# Altium schematic sheet arm-debugger.SchDoc
size A3; DrawnBy: strawberryhacker; SheetNumber: 1; SheetTotal: 1; Email: strawberryhacker@outlook.com; Github: https://github.com/strawberryhacker; Year: 2021
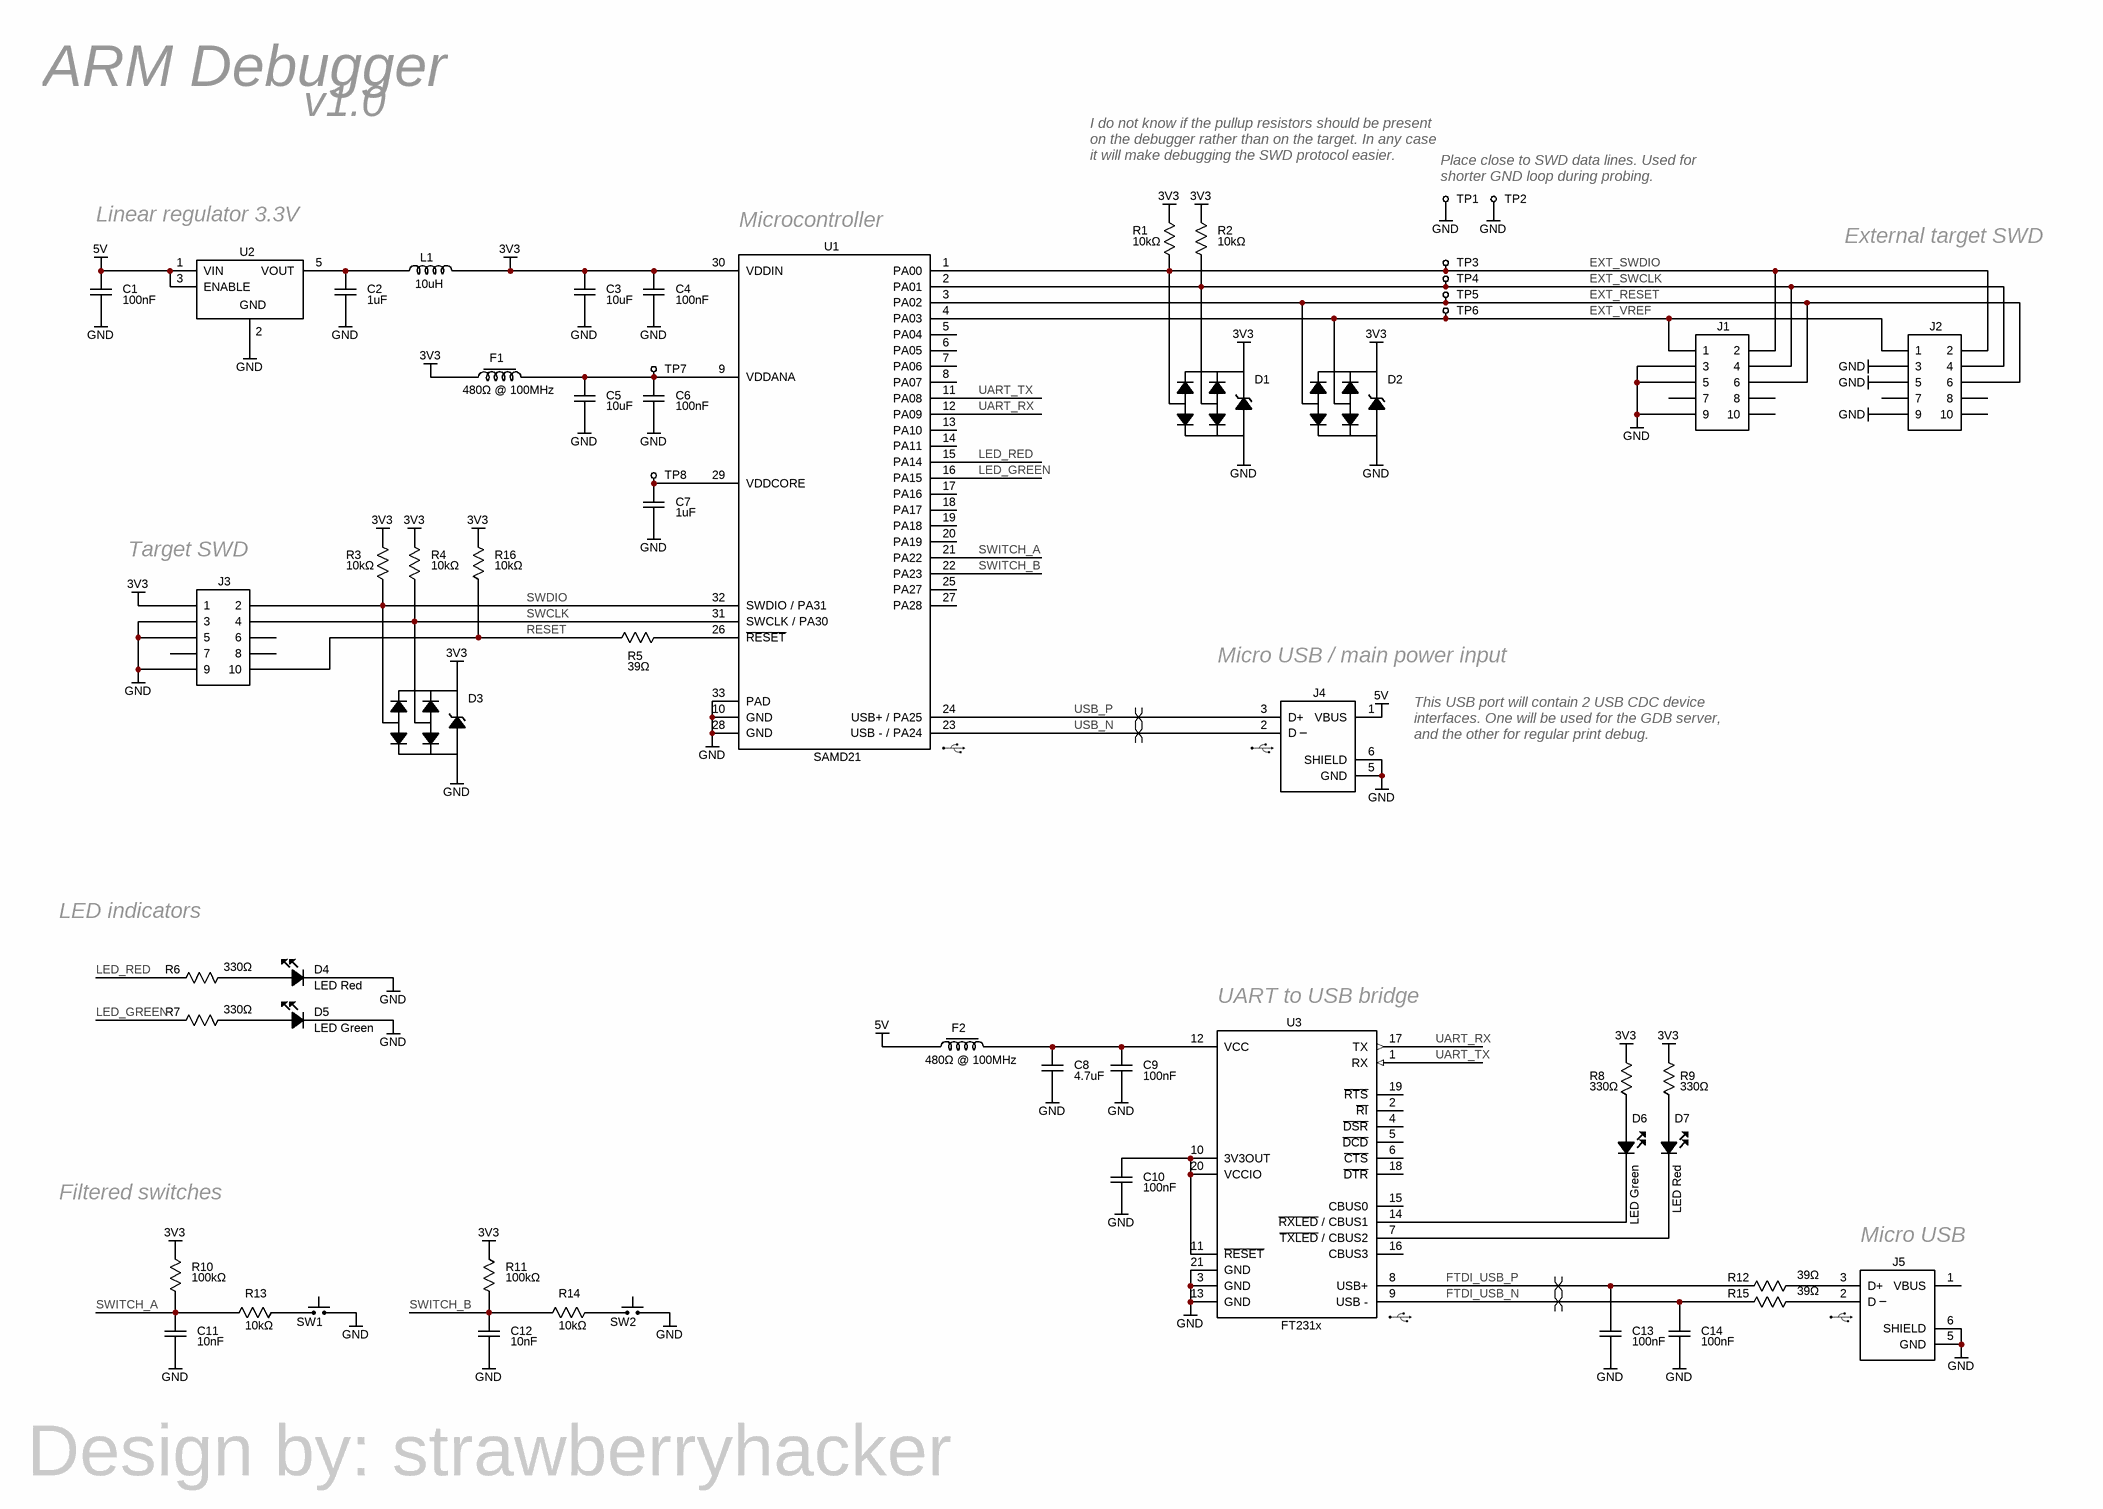
[diagram p0: arm-debugger.SchDoc]

## Parts
C1  value 100nF  [capacitor 0603]  (hidden comment: passive_5)
C2  value 1uF  [capacitor 0603]  (hidden comment: passive_5)
C3  value 10uF  [capacitor 0603]  (hidden comment: passive_5)
C4  value 100nF  [capacitor 0603]  (hidden comment: passive_5)
C5  value 10uF  [capacitor 0603]  (hidden comment: passive_5)
C6  value 100nF  [capacitor 0603]  (hidden comment: passive_5)
C7  value 1uF  [capacitor 0603]  (hidden comment: passive_5)
C8  value 4.7uF  [capacitor 0603]  (hidden comment: passive_5)
C9  value 100nF  [capacitor 0603]  (hidden comment: passive_5)
C10  value 100nF  [capacitor 0603]  (hidden comment: passive_5)
C11  value 10nF  [capacitor 0603]  (hidden comment: passive_5)
C12  value 10nF  [capacitor 0603]  (hidden comment: passive_5)
C13  value 100nF  [capacitor 0603]  (hidden comment: passive_5)
C14  value 100nF  [capacitor 0603]  (hidden comment: passive_5)
D1  diode_3  [CM1293A-02SR]  (value not drawn)
D2  diode_3  [CM1293A-02SR]  (value not drawn)
D3  diode_3  [CM1293A-02SR]  (value not drawn)
D4  LED Red  [LED 0603 red]
D5  LED Green  [LED 0603 green]
D6  LED Green  [LED 0603 green]
D7  LED Red  [LED 0603 red]
F1  value 480Ω @ 100MHz  [ferrit bead 0603]  (hidden comment: passive_8)
F2  value 480Ω @ 100MHz  [ferrit bead 0603]  (hidden comment: passive_8)
J1  Header 1.27mm  [header male 2x5, pitch 1.27mm]  (value not drawn)
J2  Header 2.54mm  [header male 2x5, pitch 2.54mm]  (value not drawn)
J3  Header 1.27mm  [header male 2x5, pitch 1.27mm]  (value not drawn)
J4  USB micro B  [USB mico B female]  (value not drawn)
J5  USB micro B  [USB mico B female]  (value not drawn)
L1  value 10uH  [inductor 0603]  (hidden comment: passive_9)
R1  value 10kΩ  [resistor 0603]  (hidden comment: passive_2)
R2  value 10kΩ  [resistor 0603]  (hidden comment: passive_2)
R3  value 10kΩ  [resistor 0603]  (hidden comment: passive_2)
R4  value 10kΩ  [resistor 0603]  (hidden comment: passive_2)
R5  value 39Ω  [resistor 0603]  (hidden comment: passive_2)
R6  value 330Ω  [resistor 0603]  (hidden comment: passive_2)
R7  value 330Ω  [resistor 0603]  (hidden comment: passive_2)
R8  value 330Ω  [resistor 0603]  (hidden comment: passive_2)
R9  value 330Ω  [resistor 0603]  (hidden comment: passive_2)
R10  value 100kΩ  [resistor 0603]  (hidden comment: passive_2)
R11  value 100kΩ  [resistor 0603]  (hidden comment: passive_2)
R12  value 39Ω  [resistor 0603]  (hidden comment: passive_2)
R13  value 10kΩ  [resistor 0603]  (hidden comment: passive_2)
R14  value 10kΩ  [resistor 0603]  (hidden comment: passive_2)
R15  value 39Ω  [resistor 0603]  (hidden comment: passive_2)
R16  value 10kΩ  [resistor 0603]  (hidden comment: passive_2)
SW1  connector_35  [KMR621NG LFS]  (value not drawn)
SW2  connector_35  [KMR621NG LFS]  (value not drawn)
TP1  misc_2  [testpoint round, diameter 1mm]  (value not drawn)
TP2  misc_2  [testpoint round, diameter 1mm]  (value not drawn)
TP3  misc_2  [testpoint round, diameter 1mm]  (value not drawn)
TP4  misc_2  [testpoint round, diameter 1mm]  (value not drawn)
TP5  misc_2  [testpoint round, diameter 1mm]  (value not drawn)
TP6  misc_2  [testpoint round, diameter 1mm]  (value not drawn)
TP7  misc_2  [testpoint round, diameter 1mm]  (value not drawn)
TP8  misc_2  [testpoint round, diameter 1mm]  (value not drawn)
U1  SAMD21  [ATSAMD21E17D-MUT]
U2  regulator_1  [TCR2EF33,LM(CT]  (value not drawn)
U3  FT231x  [FT231XQ-R]

## Nets
3V3: C3.2 C4.2 D1.4 D2.4 D3.4 F1.1 J3.1 L1.2 R1.2 R2.2 R3.2 R4.2 R8.2 R9.2 R10.2 R11.2 R16.2 U1.30(VDDIN)
5V: C1.2 F2.1 J4.1(VBUS) U2.1(VIN) U2.3(ENABLE)
GND: C1.1 C2.1 C3.1 C4.1 C5.1 C6.1 C7.1 C8.1 C9.1 C10.1 C11.1 C12.1 C13.1 C14.1 D1.1 D2.1 D3.1 D4.2 D5.2 J1.3 J1.5 J1.9 J2.3 J2.5 J2.9 J3.3 J3.5 J3.9 J4.5(GND) J4.6(SHIELD) J5.5(GND) J5.6(SHIELD) SW1.2 SW2.2 TP1.1 TP2.1 U1.10(GND) U1.28(GND) U1.33(PAD) U2.2 U3.3(GND) U3.13(GND) U3.21(GND)
EXT_RESET: D2.2 J1.6 J2.6 TP5.1 U1.3(PA02)
EXT_SWCLK: D1.3 J1.4 J2.4 R2.1 TP4.1 U1.2(PA01)
EXT_SWDIO: D1.2 J1.2 J2.2 R1.1 TP3.1 U1.1(PA00)
EXT_VREF: D2.3 J1.1 J2.1 TP6.1 U1.4(PA03)
FTDI_USB_N: C14.2 R15.2 U3.9(USB_-)
FTDI_USB_P: C13.2 R12.2 U3.8(USB+)
LED_GREEN: R7.2 U1.16(PA15)
LED_RED: R6.2 U1.15(PA14)
RESET: J3.10 R5.2 R16.1
SWCLK: D3.3 J3.4 R4.1 U1.31(SWCLK_/_PA30)
SWDIO: D3.2 J3.2 R3.1 U1.32(SWDIO_/_PA31)
SWITCH_A: C11.2 R10.1 R13.2 U1.21(PA22)
SWITCH_B: C12.2 R11.1 R14.2 U1.22(PA23)
UART_RX: U1.12(PA09) U3.17(TX)
UART_TX: U1.11(PA08) U3.1(RX)
USB_N: J4.2(D) U1.23(USB_-_/_PA24)
USB_P: J4.3(D+) U1.24(USB+_/_PA25)
NetC2_2: C2.2 L1.1 U2.5(VOUT)
NetC5_2: C5.2 C6.2 F1.2 TP7.1 U1.9(VDDANA)
NetC7_2: C7.2 TP8.1 U1.29(VDDCORE)
NetC8_2: C8.2 C9.2 F2.2 U3.12(VCC)
NetC10_2: C10.2 U3.10(3V3OUT) U3.11(~{RESET}) U3.20(VCCIO)
NetD4_1: D4.1 R6.1
NetD5_1: D5.1 R7.1
NetD6_1: D6.1 R8.1
NetD6_2: D6.2 U3.14(~{RXLED}_/_CBUS1)
NetD7_1: D7.1 R9.1
NetD7_2: D7.2 U3.7(~{TXLED}_/_CBUS2)
NetJ5_2: J5.2(D) R15.1
NetJ5_3: J5.3(D+) R12.1
NetR5_1: R5.1 U1.26(~{RESET})
NetR13_1: R13.1 SW1.1
NetR14_1: R14.1 SW2.1

Not connected (* = marked no-connect by the designer): J1 7 8 10; J2 7 8 10; J3 6 7 8; J5 1(VBUS); U1 5(PA04) 6(PA05) 7(PA06) 8(PA07) 13(PA10) 14(PA11) 17(PA16) 18(PA17) 19(PA18) 20(PA19) 25(PA27) 27(PA28); U3 2(~{RI}) 4(~{DSR}) 5(~{DCD}) 6(~{CTS}) 15(CBUS0) 16(CBUS3) 18(~{DTR}) 19(~{RTS})

## Layout directives
differential pair: FTDI_USB_N, FTDI_USB_P, USB_N, USB_P

## Notes on the sheet
- ARM Debugger
- v1.0
- I do not know if the pullup resistors should be present
- on the debugger rather than on the target. In any case
- it will make debugging the SWD protocol easier.
- Place close to SWD data lines. Used for
- shorter GND loop during probing.
- Linear regulator 3.3V
- (near U1) Microcontroller
- External target SWD
- (near J3) Target SWD
- (near J4) Micro USB / main power input
- This USB port will contain 2 USB CDC device
- interfaces. One will be used for the GDB server,
- and the other for regular print debug.
- (near R6) LED indicators
- (near U3) UART to USB bridge
- (near R10) Filtered switches
- (near J5) Micro USB
- (in symbol connector_34) _
- (in symbol regulator_1) GND

## Library data of the parts
C1-C14 = passive_5: Capacitor 0603
D1-D3 = diode_3: TVS, 2 channels, standoff 3.3V,  diode array with avalanche diode; Manufacturer 1: ON Semiconductor; Clamping voltage: 9.9V; Peak current: 1A; Supplier 1: Digi-Key; Supplier Part Number 1: CM1293A-02SROSCT-ND; Manufacturer Part Number 1: CM1293A-02SR; Reverse standoff: 3.3V; Link: https://www.digikey.no/product-detail/en/on-semiconductor/CM1293A-02SR/CM1293A-02SROSCT-ND/3487527
D4 D7 = diode_0: LED 0603 red
D5 D6 = diode_1: LED 0603 green
F1 F2 = passive_8: Ferrite bead 0603
J1 J3 = connector_17: Header male 2x5, pitch 1.27mm
J2 = connector_30: Header male 2x5, pitch 2.54mm
J4 J5 = connector_34: Manufacturer 1: Amphenol ICC (FCI); Manufacturer Part Number 1: 10118194-0001LF; Supplier 1: Digi-Key; Supplier Part Number 1: 609-4618-1-ND; Link: https://www.digikey.no/product-detail/en/amphenol-icc-fci/10118194-0001LF/609-4618-1-ND/2785382
L1 = passive_9: Inductor 0603
R1-R16 = passive_2: Resistor 0603
SW1 SW2 = connector_35: Tactile switch SMD, tiny; Manufacturer 1: C&K; Supplier 1: Digi-Key; Supplier Part Number 1: CKN10684CT-ND; Manufacturer Part Number 1: KMR621NG LFS; Link: https://www.digikey.no/product-detail/en/c-k/KMR621NG-LFS/CKN10684CT-ND/6035356
TP1-TP8 = misc_2: Test-point round, diameter 1.0mm
U1 = cpu_0: SAMD21, 48 MHz, 128KB flash, 16KB RAM, 32 pins, USB device; Manufacturer 1: Microchip Technology; Supplier 1: Digi-Key; Supplier Part Number 1: ATSAMD21E17D-MUTTR-ND; Manufacturer Part Number 1: ATSAMD21E17D-MUT; Link: https://www.digikey.no/products/no?keywords=ATSAMD21E17D-MUTTR-ND
U2 = regulator_1: LDO fixed, 3.3V output, 0.2V dropout, 200mA; Manufacturer 1: Toshiba Semiconductor and Storage; Supplier 1: Digi-Key; Supplier Part Number 1: TCR2EF33LM(CTCT-ND; Manufacturer Part Number 1: TCR2EF33,LM(CT; Output voltage: 3.3V; Dropout (max): 0.2V; Current (max): 200mA; Link: https://www.digikey.no/product-detail/en/toshiba-semiconductor-and-storage/TCR2EF33-LM-CT/TCR2EF33LM-CTCT-ND/4503328
U3 = ic_1: USB to UART converter, FTDI, single; Manufacturer 1: FTDI, Future Technology Devices International Ltd; Supplier 1: Digi-Key; Supplier Part Number 1: 768-1128-1-ND; Manufacturer Part Number 1: FT231XQ-R